# EAGLE design HEAD_IO_RevB (EAGLE 7.7.0)
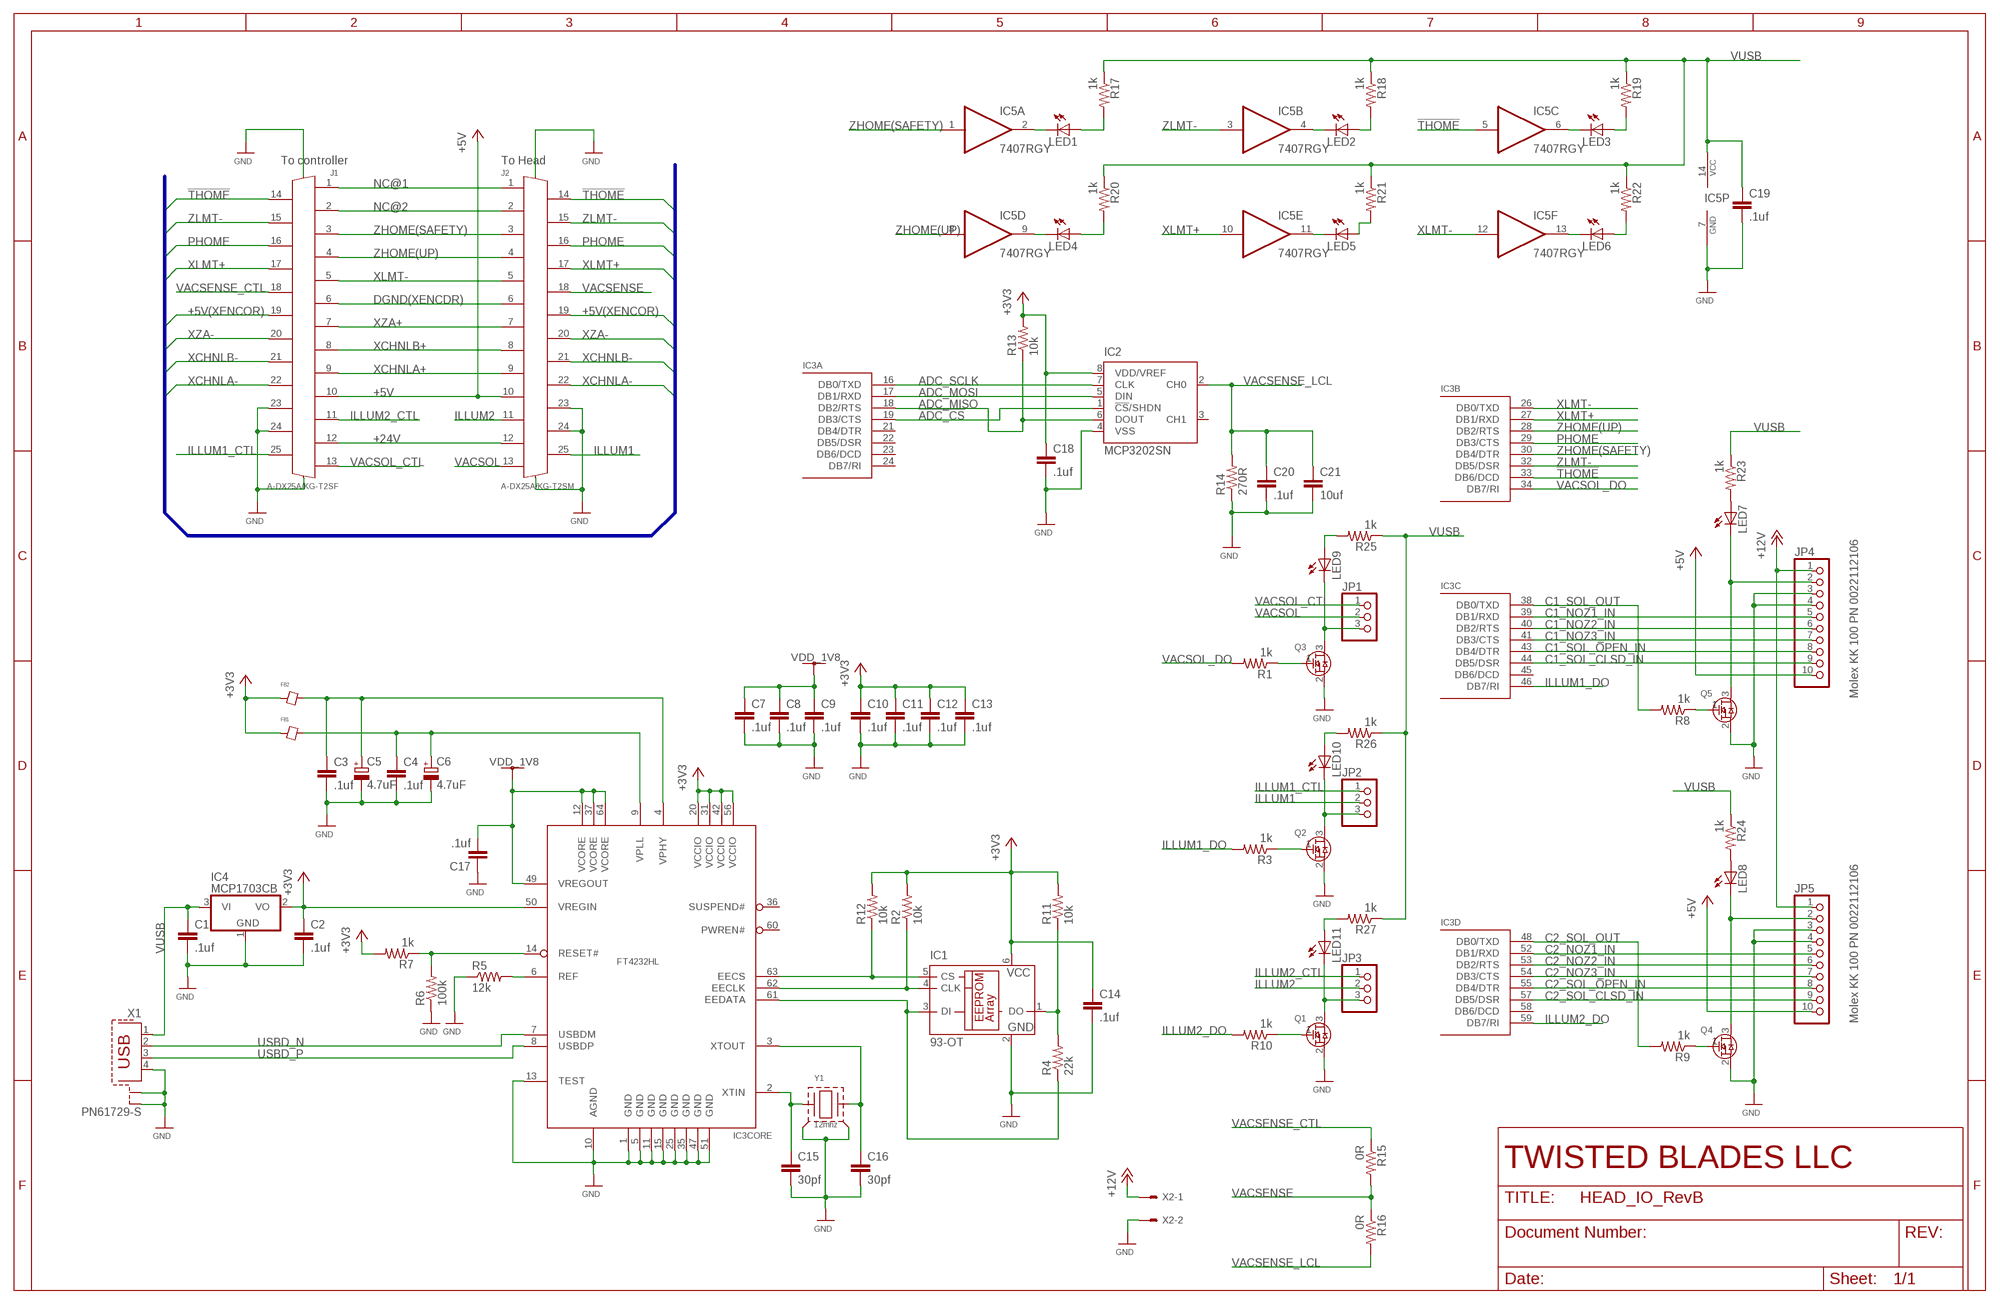
[diagram p0: schematic, sheet 1]

## Parts
C1  .1uf  C-EUC0603  [C0603]
C2  .1uf  C-EUC0603  [C0603]
C3  .1uf  C-EUC0603  [C0603]
C4  .1uf  C-EUC0603  [C0603]
C5  4.7uF  CPOL-EUA/3216-18R  [A/3216-18R]
C6  4.7uF  CPOL-EUA/3216-18R  [A/3216-18R]
C7  .1uf  C-EUC0603  [C0603]
C8  .1uf  C-EUC0603  [C0603]
C9  .1uf  C-EUC0603  [C0603]
C10  .1uf  C-EUC0603  [C0603]
C11  .1uf  C-EUC0603  [C0603]
C12  .1uf  C-EUC0603  [C0603]
C13  .1uf  C-EUC0603  [C0603]
C14  .1uf  C-EUC0603  [C0603]
C15  30pf  C-EUC0603  [C0603]
C16  30pf  C-EUC0603  [C0603]
C17  .1uf  C-EUC0603  [C0603]
C18  .1uf  C-EUC0603  [C0603]
C19  .1uf  C-EUC0603  [C0603]
C20  .1uf  C-EUC0603  [C0603]
C21  10uf  C-EUC0805K  [C0805K]
FB1  FERRITE0603  [0603]
FB2  FERRITE0603  [0603]
IC1  93-OT  [SOT23-6]
IC2  MCP3202SN  [SO-08]
IC3  FT4232HL  [LQFP64]
IC4  MCP1703CB  [SOT23]
IC5  7407RGY  [TI_VQFN14]
J1  A-DX25A/KG-T2SF  [A-DF25A/KG-T2S]
J2  A-DX25A/KG-T2SM  [A-DS25A/KG-T2S]
JP1  PINHD-1X3  [1X03]
JP2  PINHD-1X3  [1X03]
JP3  PINHD-1X3  [1X03]
JP4  PINHD-1X10  [1X10]
JP5  PINHD-1X10  [1X10]
LED1  LEDCHIP-LED0603  [CHIP-LED0603]
LED2  LEDCHIP-LED0603  [CHIP-LED0603]
LED3  LEDCHIP-LED0603  [CHIP-LED0603]
LED4  LEDCHIP-LED0603  [CHIP-LED0603]
LED5  LEDCHIP-LED0603  [CHIP-LED0603]
LED6  LEDCHIP-LED0603  [CHIP-LED0603]
LED7  LEDCHIP-LED0603  [CHIP-LED0603]
LED8  LEDCHIP-LED0603  [CHIP-LED0603]
LED9  LEDCHIP-LED0603  [CHIP-LED0603]
LED10  LEDCHIP-LED0603  [CHIP-LED0603]
LED11  LEDCHIP-LED0603  [CHIP-LED0603]
Q1  FDN86246  [SOT23C]
Q2  FDN86246  [SOT23C]
Q3  FDN86246  [SOT23C]
Q4  FDN86246  [SOT23C]
Q5  FDN86246  [SOT23C]
R1  1k  R-US_R0603  [R0603]
R2  10k  R-US_R0603  [R0603]
R3  1k  R-US_R0603  [R0603]
R4  22k  R-US_R0603  [R0603]
R5  12k  R-US_R0603  [R0603]
R6  100k  R-US_R0603  [R0603]
R7  1k  R-US_R0603  [R0603]
R8  1k  R-US_R0603  [R0603]
R9  1k  R-US_R0603  [R0603]
R10  1k  R-US_R0603  [R0603]
R11  10k  R-US_R0603  [R0603]
R12  10k  R-US_R0603  [R0603]
R13  10k  R-US_R0603  [R0603]
R14  270R  R-US_R0603  [R0603]
R15  0R  R-US_R0603  [R0603]
R16  0R  R-US_R0603  [R0603]
R17  1k  R-US_R0603  [R0603]
R18  1k  R-US_R0603  [R0603]
R19  1k  R-US_R0603  [R0603]
R20  1k  R-US_R0603  [R0603]
R21  1k  R-US_R0603  [R0603]
R22  1k  R-US_R0603  [R0603]
R23  1k  R-US_R0603  [R0603]
R24  1k  R-US_R0603  [R0603]
R25  1k  R-US_R0603  [R0603]
R26  1k  R-US_R0603  [R0603]
R27  1k  R-US_R0603  [R0603]
X1  PN61729-S  [PN61729-S]
X2  KK-156-2  [KK-156-2]
Y1  12mhz  ABM8G  [ABM8G]

## Nets
!ADC_CS: IC2.1(!CS!/SHDN) IC3.19(A:DB3/CTS)
!RESET: IC3.14(CORE:RESET#) R6.2 R7.1
!THOME: IC3.33(B:DB6/DCD) IC5.5(C:I) J1.14 J2.14
+3V3: C2.1 C10.1 C11.1 C12.1 C13.1 C14.1 C18.1 FB1.P$1 FB2.P$1 IC1.6(VCC) IC2.8(VDD/VREF) IC3.20(CORE:VCCIO) IC3.31(CORE:VCCIO) IC3.42(CORE:VCCIO) IC3.50(CORE:VREGIN) IC3.56(CORE:VCCIO) IC4.2(VO) R2.2 R7.2 R11.2 R12.2 R13.2
+5V: J1.10 J2.10 JP4.10 JP5.10
+5V(XENCOR): J1.19 J2.19
+12V: JP4.1 JP5.1 X2.1
+24V: J1.12 J2.12
ADC_MISO: IC2.6(DOUT) IC3.18(A:DB2/RTS) R13.1
ADC_MOSI: IC2.5(DIN) IC3.17(A:DB1/RXD)
ADC_SCLK: IC2.7(CLK) IC3.16(A:DB0/TXD)
C1_NOZ1_IN: IC3.39(C:DB1/RXD) JP4.5
C1_NOZ2_IN: IC3.40(C:DB2/RTS) JP4.6
C1_NOZ3_IN: IC3.41(C:DB3/CTS) JP4.7
C1_SOL_CLSD_IN: IC3.44(C:DB5/DSR) JP4.9
C1_SOL_OPEN_IN: IC3.43(C:DB4/DTR) JP4.8
C1_SOL_OUT: IC3.38(C:DB0/TXD) R8.2
C2_NOZ1_IN: IC3.52(D:DB1/RXD) JP5.5
C2_NOZ2_IN: IC3.53(D:DB2/RTS) JP5.6
C2_NOZ3_IN: IC3.54(D:DB3/CTS) JP5.7
C2_SOL_CLSD_IN: IC3.57(D:DB5/DSR) JP5.9
C2_SOL_OPEN_IN: IC3.55(D:DB4/DTR) JP5.8
C2_SOL_OUT: IC3.48(D:DB0/TXD) R9.2
DGND(XENCDR): J1.6 J2.6
GND: C1.2 C2.2 C3.2 C4.2 C5.- C6.- C7.2 C8.2 C9.2 C10.2 C11.2 C12.2 C13.2 C14.2 C15.2 C16.2 C17.1 C18.2 C19.2 C20.2 C21.2 IC1.2(GND) IC2.4(VSS) IC3.1(CORE:GND) IC3.5(CORE:GND) IC3.10(CORE:AGND) IC3.11(CORE:GND) IC3.13(CORE:TEST) IC3.15(CORE:GND) IC3.25(CORE:GND) IC3.35(CORE:GND) IC3.47(CORE:GND) IC3.51(CORE:GND) IC4.1(GND) IC5.7(P:GND) J1.23 J1.24 J1.SHLD@1(SHLD) J1.SHLD@2(SHLD) J2.23 J2.24 J2.SHLD@1(SHLD) J2.SHLD@2(SHLD) JP4.3 JP4.4 JP5.3 JP5.4 Q1.2(S) Q2.2(S) Q3.2(S) Q4.2(S) Q5.2(S) R5.1 R6.1 R14.1 X1.4 X1.S1 X1.S2 X2.2 Y1.2(GND) Y1.4(GND)
ILLUM1: J2.25 JP2.2
ILLUM1_CTL: J1.25 JP2.1
ILLUM1_DO: IC3.46(C:DB7/RI) R3.2
ILLUM2: J2.11 JP3.2
ILLUM2_CTL: J1.11 JP3.1
ILLUM2_DO: IC3.59(D:DB7/RI) R10.2
N$1: JP1.3 LED9.C Q3.3(D)
N$2: Q3.1(G) R1.1
N$3: JP2.3 LED10.C Q2.3(D)
N$4: Q2.1(G) R3.1
N$5: JP3.3 LED11.C Q1.3(D)
N$6: Q1.1(G) R10.1
N$7: C16.1 IC3.3(CORE:XTOUT) Y1.3
N$8: IC3.6(CORE:REF) R5.2
N$9: C3.1 C5.+ FB2.P$2 IC3.4(CORE:VPHY)
N$10: C15.1 IC3.2(CORE:XTIN) Y1.1
N$11: IC1.1(DO) R4.2 R11.1
N$12: IC5.2(A:O) LED1.C
N$13: IC5.4(B:O) LED2.C
N$14: IC1.5(CS) IC3.63(CORE:EECS) R12.1
N$15: IC1.4(CLK) IC3.62(CORE:EECLK) R2.1
N$16: IC1.3(DI) IC3.61(CORE:EEDATA) R4.1
N$17: IC5.6(C:O) LED3.C
N$18: IC5.9(D:O) LED4.C
N$19: C4.1 C6.+ FB1.P$2 IC3.9(CORE:VPLL)
N$20: IC5.11(E:O) LED5.C
N$21: IC5.13(F:O) LED6.C
N$22: LED1.A R17.2
N$23: LED2.A R18.2
N$24: LED3.A R19.2
N$25: LED5.A R21.2
N$26: LED6.A R22.2
N$27: LED4.A R20.2
N$28: LED7.A R23.2
N$29: LED8.A R24.2
N$30: LED11.A R27.2
N$31: Q4.1(G) R9.1
N$32: Q5.1(G) R8.1
N$33: LED9.A R25.2
N$34: LED10.A R26.2
NC@1: J1.1 J2.1
NC@2: J1.2 J2.2
PHOME: IC3.29(B:DB3/CTS) J1.16 J2.16
USBD_N: IC3.7(CORE:USBDM) X1.2
USBD_P: IC3.8(CORE:USBDP) X1.3
VAC1_SW: JP4.2 LED7.C Q5.3(D)
VAC2_SW: JP5.2 LED8.C Q4.3(D)
VACSENSE: J2.18 R15.2 R16.1
VACSENSE_CTL: J1.18 R15.1
VACSENSE_LCL: C20.1 C21.1 IC2.2(CH0) R14.2 R16.2
VACSOL: J2.13 JP1.2
VACSOL_CTL: J1.13 JP1.1
VACSOL_DO: IC3.34(B:DB7/RI) R1.2
VDD_1V8: C7.1 C8.1 C9.1 C17.2 IC3.12(CORE:VCORE) IC3.37(CORE:VCORE) IC3.49(CORE:VREGOUT) IC3.64(CORE:VCORE)
VUSB: C1.1 C19.1 IC4.3(VI) IC5.14(P:VCC) R17.1 R18.1 R19.1 R20.1 R21.1 R22.1 R23.1 R24.1 R25.1 R26.1 R27.1 X1.1
XCHNLA+: J1.9 J2.9
XCHNLA-: J1.22 J2.22
XCHNLB+: J1.8 J2.8
XCHNLB-: J1.21 J2.21
XLMT+: IC3.27(B:DB1/RXD) IC5.10(E:I) J1.17 J2.17
XLMT-: IC3.26(B:DB0/TXD) IC5.12(F:I) J1.5 J2.5
XZA+: J1.7 J2.7
XZA-: J1.20 J2.20
ZHOME(SAFETY): IC3.30(B:DB4/DTR) IC5.1(A:I) J1.3 J2.3
ZHOME(UP): IC3.28(B:DB2/RTS) IC5.8(D:I) J1.4 J2.4
ZLMT-: IC3.32(B:DB5/DSR) IC5.3(B:I) J1.15 J2.15
Unconnected: IC2.3(CH1) IC3.21(A:DB4/DTR) IC3.22(A:DB5/DSR) IC3.23(A:DB6/DCD) IC3.24(A:DB7/RI) IC3.36(CORE:SUSPEND#) IC3.45(C:DB6/DCD) IC3.58(D:DB6/DCD) IC3.60(CORE:PWREN#)

## Buses
THOME,ZLMT-,PHOME,XLMT+,+5V(XENCOR),XZA-,XCHNLB-,XCHNLA-

## Notes on the sheet
- To controller | To Head
- Molex KK 100 PN 0022112106
- Molex KK 100 PN 0022112106

## Library data of the parts
C1-C4 C7-C21 = C_rcl:C-EU: CAPACITOR, European symbol
C5 C6 = C_rcl:CPOL-EU: POLARIZED CAPACITOR, European symbol
FB1 FB2 = C_TwistedBlades:FERRITE
IC1 = C_microchip:93-*: Serial EEPROM 512 x 8 bit/256 x 16 bit/1 K/4 K, 5.0 V, Microwire; DIGIKEYPN: 93LC46BT-I/OTCT-ND
IC2 = C_microchip:MCP3202: 2.7V Dual Channel 12-Bit A/D Converter with SPI Serial Interface Source: http://ww1.microchip.com/downloads/en/DeviceDoc/21034D.pdf
IC3 = ftdichip-6:FT4232H: Quad USB UART 5th generation USB to 4-port serial controller
IC4 = C_linear:MCP1703: 250 mA, 16V, Low Quiescent Current LDO Regulator Source: http://ww1.microchip.com/downloads/en/DeviceDoc/22049b.pdf
IC5 = C_TwistedBlades:74*07: Hex BUFFER, open collector high-voltage output
J1 J2 = C_TwistedBlades:A-DX25A/KG-T2S: DB25 Connector Assmann A-D(F|S) 25 A/KG-T2S
JP1-JP3 = C_pinhead:PINHD-1X3: PIN HEADER
JP4 JP5 = pinhead:PINHD-1X10: PIN HEADER
LED1-LED11 = led-new:LED: LED OSRAM: - CHIPLED LG R971, LG N971, LY N971, LG Q971, LY Q971, LO R971, LY R971 LH N974, LH R974 LS Q976, LO Q976, LY Q976 LO Q996 - Hyper CHIPLED LW Q18S LB Q993, LB Q99A, LB R99A - SideLED LS A670, LO A670, LY A670, LG A670, LP A670 LB A673, LV A673, LT A673, LW A673 LH A674 LY A675 LS A676, LA A676, LO A676, LY A676, LW A676 LS A679, LY A679, LG A679 - Hyper Micro SIDELED® LS Y876, LA Y876, LO Y876, LY Y876 LT Y87S - SmartLED LW L88C, LW L88S LB L89C, LB L89S, LG L890 LS L89K, LO L89K, LY L89K LS L896, LA L896, LO L896, LY L896 - TOPLED LS T670, LO T670, LY T670, LG T670, LP T670 LSG T670, LSP T670, LSY T670, LOP T670, LYG T670 LG T671, LOG T671, LSG T671 LB T673, LV T673, LT T673, LW T673 LH T674 LS T676, LA T676, LO T676, LY T676, LB T676, LH T676, LSB T676, LW T676 LB T67C, LV T67C, LT T67C, LS T67K, LO T67K, LY T67K, LW E67C LS E67B, LA E67B, LO E67B, LY E67B, LB E67C, LV E67C, LT E67C LW T67C LS T679, LY T679, LG T679 LS T770, LO T770, LY T770, LG T770, LP T770 LB T773, LV T773, LT T773, LW T773 LH T774 LS E675, LA E675, LY E675, LS T675 LS T776, LA T776, LO T776, LY T776, LB T776 LHGB T686 LT T68C, LB T68C - Hyper Mini TOPLED® LB M676 - Mini TOPLED Santana® LG M470 LS M47K, LO M47K, LY M47K Source: http://www.osram.convergy.de LUXEON: - LUMILED® LXK2-PW12-R00, LXK2-PW12-S00, LXK2-PW14-U00, LXK2-PW14-V00 LXK2-PM12-R00, LXK2-PM12-S00, LXK2-PM14-U00 LXK2-PE12-Q00, LXK2-PE12-R00, LXK2-PE12-S00, LXK2-PE14-T00, LXK2-PE14-U00 LXK2-PB12-K00, LXK2-PB12-L00, LXK2-PB12-M00, LXK2-PB14-N00, LXK2-PB14-P00, LXK2-PB14-Q00 LXK2-PR12-L00, LXK2-PR12-M00, LXK2-PR14-Q00, LXK2-PR14-R00 LXK2-PD12-Q00, LXK2-PD12-R00, LXK2-PD12-S00 LXK2-PH12-R00, LXK2-PH12-S00 LXK2-PL12-P00, LXK2-PL12-Q00, LXK2-PL12-R00 Source: www.luxeon.com KINGBRIGHT: KA-3528ASYC Source: www.kingbright.com
Q1-Q5 = C_TwistedBlades:FDN86246: N-Channel PowerTrench® MOSFET 150 V, 1.6 A, 261 m http://www.fairchildsemi.com/ds/FD/FDN86246.pdf
R1-R27 = C_rcl:R-US_: RESISTOR, American symbol
X1 = con-berg:PN61729-S: BERG USB connector; DIGIKEYPN: 609-1039-ND; OC_FARNELL: unknown; OC_NEWARK: unknown
X2 = C_con-molex:KK-156-2: KK 156 HEADER Source: http://www.molex.com/pdm_docs/sd/026604100_sd.pdf; DIGIKEYPN: WM50008-02-ND; OC_FARNELL: unknown; OC_NEWARK: unknown
Y1 = C_TwistedBlades:ABM8G: Abracon Crystal http://www.abracon.com/Support/PackageDrawing/Resonators/ABM8G.PDF; DIGIKEYPN: 535-10261-1-ND

## Board
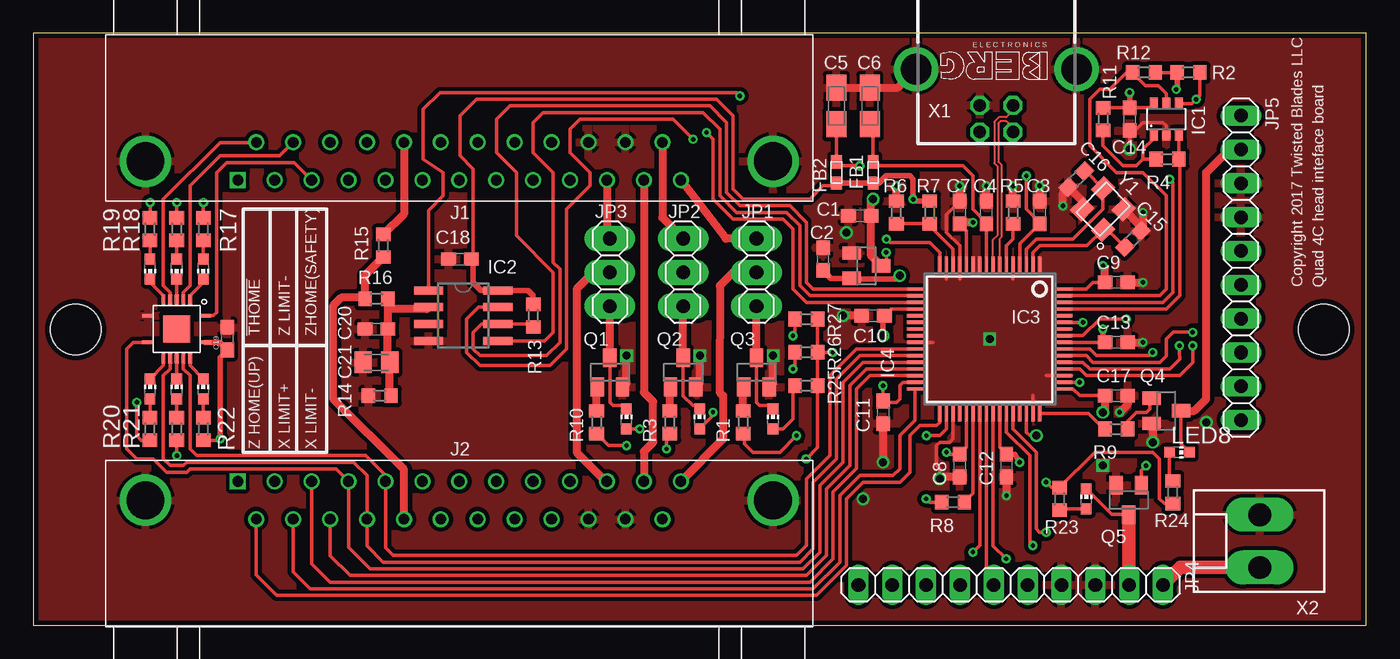
[diagram p1: board, top side]
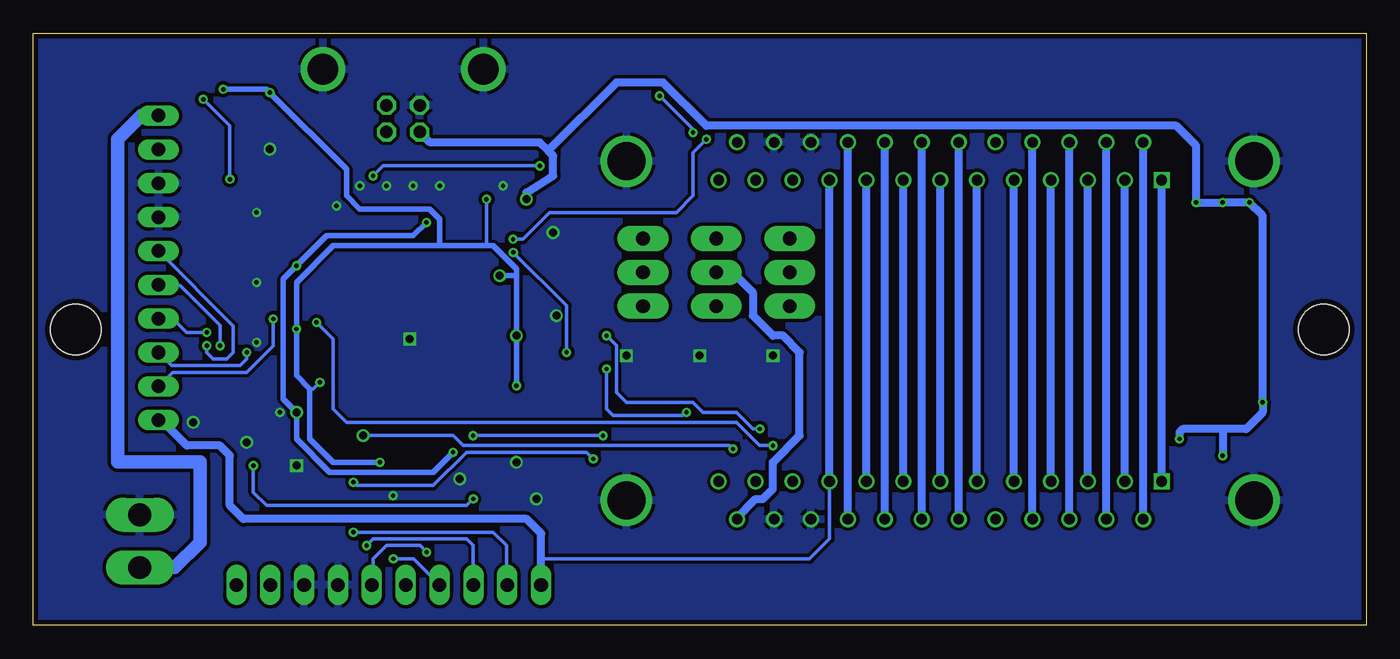
[diagram p2: board, bottom side, seen from below]

Size 100.01 x 44.45 mm. Coordinates in mm from the lower left corner, seen from the top.
Outline: 0,0 100.01,0 100.01,44.45 0,44.45 0,0
Copper layers (1*16): Top 0.0356mm / dielectric 1.5011mm / Bottom 0.0356mm
Design rules "LaenPCBOrder *": minimum track width 6mil, minimum drill 13mil, track to track 6mil, track to pad 6mil, pad to pad 6mil, via to via 6mil, smd to smd 6mil, copper to edge 15mil, drill to drill 6mil, minimum pad ring 7mil, minimum via ring 7mil, stop-mask expansion 3mil, vias tented up to drill 25mil, thermal gap 10mil
Holes 3.81 mm at 3.17,22.23 96.84,22.23

### Footprints (pad centres in the part's own frame; a part is rotated, then mirrored left to right if it is on the bottom)
C0603 = smd 1.1 x 1: 1 -0.85,0; 2 0.85,0
A/3216-18R = smd 1.95 x 1.5: + 1.375,0; - -1.375,0
C0805K = smd 1.3 x 1.6: 1 -1,0; 2 1,0
0603 = smd 1 x 0.8: P$1 -0.8,0; P$2 0.8,0
SOT23-6 = smd 0.6 x 0.9: 1 -0.95,-1.15; 2 0,-1.15; 3 0.95,-1.15; 4 0.95,1.15; 5 0,1.15; 6 -0.95,1.15
SO-08 = smd 0.6 x 2.2: 1 -1.905,-2.6; 2 -0.635,-2.6; 3 0.635,-2.6; 4 1.905,-2.6; 5 1.905,2.6; 6 0.635,2.6; 7 -0.635,2.6; 8 -1.905,2.6
LQFP64 = smd 0.25 x 1.2: 1 -3.75,-5.6; 2 -3.25,-5.6; 3 -2.75,-5.6; 4 -2.25,-5.6; 5 -1.75,-5.6; 6 -1.25,-5.6; 7 -0.75,-5.6; 8 -0.25,-5.6; 9 0.25,-5.6; 10 0.75,-5.6; 11 1.25,-5.6; 12 1.75,-5.6; 13 2.25,-5.6; 14 2.75,-5.6; 15 3.25,-5.6; 16 3.75,-5.6; 33 3.75,5.6; 34 3.25,5.6; 35 2.75,5.6; 36 2.25,5.6; 37 1.75,5.6; 38 1.25,5.6; 39 0.75,5.6; 40 0.25,5.6; 41 -0.25,5.6; 42 -0.75,5.6; 43 -1.25,5.6; 44 -1.75,5.6; 45 -2.25,5.6; 46 -2.75,5.6; 47 -3.25,5.6; 48 -3.75,5.6 | smd 1.2 x 0.25: 17 5.6,-3.75; 18 5.6,-3.25; 19 5.6,-2.75; 20 5.6,-2.25; 21 5.6,-1.75; 22 5.6,-1.25; 23 5.6,-0.75; 24 5.6,-0.25; 25 5.6,0.25; 26 5.6,0.75; 27 5.6,1.25; 28 5.6,1.75; 29 5.6,2.25; 30 5.6,2.75; 31 5.6,3.25; 32 5.6,3.75; 49 -5.6,3.75; 50 -5.6,3.25; 51 -5.6,2.75; 52 -5.6,2.25; 53 -5.6,1.75; 54 -5.6,1.25; 55 -5.6,0.75; 56 -5.6,0.25; 57 -5.6,-0.25; 58 -5.6,-0.75; 59 -5.6,-1.25; 60 -5.6,-1.75; 61 -5.6,-2.25; 62 -5.6,-2.75; 63 -5.6,-3.25; 64 -5.6,-3.75
SOT23 = smd 1 x 1.4: 1 -0.95,-1.1; 2 0.95,-1.1; 3 0,1.1
TI_VQFN14 = smd 0.85 x 0.28: 1 -2.15,-1; 7 2.15,-1; 8 2.15,1; 14 -2.15,1 | smd 0.28 x 0.85: 2 -1,-2.15; 3 -0.5,-2.15; 4 0,-2.15; 5 0.5,-2.15; 6 1,-2.15; 9 1,2.15; 10 0.5,2.15; 11 0,2.15; 12 -0.5,2.15; 13 -1,2.15 | smd 2.05 x 2.05: PAD 0,0
A-DF25A/KG-T2S = drill 0.8 square: 1 16.62,1.42 | drill 0.8: 2 13.85,1.42; 3 11.08,1.42; 4 8.31,1.42; 5 5.54,1.42; 6 2.77,1.42; 7 0,1.42; 8 -2.77,1.42; 9 -5.54,1.42; 10 -8.31,1.42; 11 -11.08,1.42; 12 -13.85,1.42; 13 -16.62,1.42; 14 15.235,-1.42; 15 12.465,-1.42; 16 9.695,-1.42; 17 6.925,-1.42; 18 4.155,-1.42; 19 1.385,-1.42; 20 -1.385,-1.42; 21 -4.155,-1.42; 22 -6.925,-1.42; 23 -9.695,-1.42; 24 -12.465,-1.42; 25 -15.235,-1.42 | drill 2.84: SHLD@1 -23.545,0; SHLD@2 23.545,0
A-DS25A/KG-T2S = drill 0.8 square: 1 -16.62,1.42 | drill 0.8: 2 -13.85,1.42; 3 -11.08,1.42; 4 -8.31,1.42; 5 -5.54,1.42; 6 -2.77,1.42; 7 0,1.42; 8 2.77,1.42; 9 5.54,1.42; 10 8.31,1.42; 11 11.08,1.42; 12 13.85,1.42; 13 16.62,1.42; 14 -15.235,-1.42; 15 -12.465,-1.42; 16 -9.695,-1.42; 17 -6.925,-1.42; 18 -4.155,-1.42; 19 -1.385,-1.42; 20 1.385,-1.42; 21 4.155,-1.42; 22 6.925,-1.42; 23 9.695,-1.42; 24 12.465,-1.42; 25 15.235,-1.42 | drill 2.84: SHLD@1 -23.545,0; SHLD@2 23.545,0
1X03 = drill 1.016 pad 1.93 long: 1 -2.54,0; 2 0,0; 3 2.54,0
1X10 = drill 1.016 long: 1 -11.43,0; 2 -8.89,0; 3 -6.35,0; 4 -3.81,0; 5 -1.27,0; 6 1.27,0; 7 3.81,0; 8 6.35,0; 9 8.89,0; 10 11.43,0
CHIP-LED0603 = smd 0.8 x 0.8: A 0,-0.75; C 0,0.75
SOT23C = smd 1 x 1.4: 1 -0.95,-1.1; 2 0.95,-1.1; 3 0,1.1
R0603 = smd 1 x 1.1: 1 -0.85,0; 2 0.85,0
PN61729-S = drill 0.95 octagon: 1 1.25,4.71; 2 -1.25,4.71; 3 -1.25,2.71; 4 1.25,2.71 | drill 2.3 pad 2.9: S1 -6.02,0; S2 6.02,0
KK-156-2 = drill 1.7 pad 2.184 long: 1 -1.98,0; 2 1.98,0
ABM8G = smd 1.4 x 1.2: 1 -1.1,-1.1; 2 1.1,-1.1; 3 1.1,1.1; 4 -1.1,1.1

### Placement (x,y rotation side)
C1  62.01,30.75 180 top
C2  59.26,27.5 90 top
C3  75.51,31 90 top
C4  71.51,31 90 top
C5  60.26,39 270 top
C6  62.76,39 270 top
C7  69.51,31 90 top
C8  69.51,12 270 top
C9  81.26,25.75 0 top
C10  63.01,23.25 180 top
C11  63.76,16 270 top
C12  73.01,12 270 top
C13  81.26,21.25 0 top
C14  82.26,38 270 top
C15  82.51,29 45 top
C16  78.26,33.5 225 top
C17  81.26,17.25 180 top
C18  32.01,27.5 180 top
C19  14.56,21.52 90 top
C20  25.75,22.25 180 top
C21  25.75,19.75 180 top
FB1  63.01,34 90 top
FB2  60.26,34 90 top
IC1  85.01,38 0 top
IC2  32.26,23.25 270 top
IC3  71.76,21.5 180 top
IC4  62.51,27 270 top
IC5  10.76,22.25 180 top
J1  31.96,34.85 180 top
J2  31.96,9.4 0 top
JP1  54.26,26.5 270 top
JP2  48.76,26.5 270 top
JP3  43.26,26.5 270 top
JP4  73.34,3.05 180 top
JP5  90.61,26.84 270 top
LED1  12.76,26.75 180 top
LED2  10.76,26.75 180 top
LED3  8.76,26.75 180 top
LED4  8.76,17.75 0 top
LED5  10.76,17.75 0 top
LED6  12.76,17.75 0 top
LED7  79,9.5 0 top
LED8  86,13 270 top
LED9  55.5,15.5 0 top
LED10  50,15.5 0 top
LED11  44.5,15.5 0 top
Q1  43.26,19 0 top
Q2  48.76,19 0 top
Q3  54.26,19 0 top
Q4  85.01,16.11 270 top
Q5  82.2,9.43 180 top
R1  53.26,15.25 270 top
R2  86.67,41.5 180 top
R3  47.76,15.25 270 top
R4  85.1,35 180 top
R5  73.51,31 270 top
R6  64.76,31 270 top
R7  67.26,31 90 top
R8  69.01,9.25 0 top
R9  81.26,14.75 180 top
R10  42.26,15.25 270 top
R11  80.26,38 90 top
R12  83.34,41.5 0 top
R13  37.51,23.25 90 top
R14  26,17.24 0 top
R15  26.26,28.5 270 top
R16  25.75,24.51 0 top
R17  12.76,29.75 270 top
R18  10.76,29.75 270 top
R19  8.76,29.75 270 top
R20  8.76,14.75 90 top
R21  10.76,14.75 90 top
R22  12.76,14.75 90 top
R23  77,9.5 270 top
R24  85.5,10 90 top
R25  58,18 180 top
R26  58,20.5 180 top
R27  58,23 180 top
X1  72.26,41.75 180 top
X2  92.03,6.33 90 top
Y1  80.26,31.25 45 top

### Tracks (layer width: path | path; a pad name or v marks a point on that pad's centre or on a via)
!ADC_CS  (via drill 0.33)
  Top 0.254: IC2.1 29.66,31.15 30.76,32.25 30.76,34 29.26,35 29.26,38.75 30.51,40 52.76,40 v53.01,39.75 | IC3.19 58.01,24.25 57.01,25.25 57.01,29.75 56.26,30.5 52.51,30.5 51.01,32 51.01,36.5 v50.51,37
  Bottom 0.254: v50.51,37 50.51,37.25 v53.01,39.75
!RESET
  Top 0.254: IC3.14 69.01,28.25 67.51,29.75 R7.1 R6.2
!THOME
  Top 0.254: J2.14 16.73,3.79 18.26,2.25 58.76,2.25 61.01,4.5 61.01,9.5 62.26,10.75 65.01,10.75 65.76,11.5 65.76,14.25 66.51,15 67.76,15 68.01,15.25 IC3.33 | IC5.5 10.26,25 9.76,25.5 9.76,32 14.01,36.25 16.71,36.25 J1.14
  Bottom 0.61: J2.14 J1.14
+3V3  (via drill 0.33, 0.6)
  Top 0.254: C13.1 IC3.56 | IC3.42 72.51,13.35 C12.1 | R11.2 C14.1 83.76,38.85 IC1.6 | IC3.50 v78.51,18.25 | 33.01,27.35 33.01,34.25 32.01,35.25 32.01,38.25 33.26,39.5 51.26,39.5 52.51,38.25 52.51,32.75 53.26,32 58.26,32 59.26,33 60.06,33 FB2.P$1 | IC3.20 64.36,23.75 C10.1 | IC3.31 65.26,18.25 65.01,18 65.01,17 64.76,16.75 63.86,16.75 C11.1 v63.76,18 | R2.2 R12.2
  Top 0.406: v80.26,22.25 80.26,21.4 C13.1 | v74.01,12.25 73.66,12.85 C12.1 | R7.2 66.16,31.85 v66.01,32 66.01,33.5 65.76,33.75 64.01,33.75 63.46,33.2 FB1.P$1 FB2.P$1 | C14.1 v82.26,40 | v63.76,21.75 63.76,23.15 C10.1 | 33.01,27.35 33.01,25.75 33.61,25.16 IC2.8 37.11,25.16 37.51,24.75 R13.2 | v65.01,26.25 64.76,26 61.46,26 IC4.2 59.86,26.05 C2.1 | R2.2 85.83,40.31 v85.76,40.25
  Top 0.61: 61.31,26.15 IC4.2 | 33.01,27.35 C18.1
  Bottom 0.254: v78.51,18.25 79.01,17.75 79.26,17.75 | v66.01,32 66.01,28.5
  Bottom 0.406: v74.01,12.25 77.51,12.25 79.26,14 79.26,17.75 80.26,18.75 v80.26,22.25 80.26,25.75 77.51,28.5 69.51,28.5 | 69.51,28.5 66.01,28.5 65.51,28.5 63.76,26.75 63.76,26.25 | 63.76,26.25 v63.76,21.75 v63.76,18 | 69.51,28.5 69.51,30.5 70.26,31.25 75.51,31.25 76.51,32.25 76.51,34.25 v82.26,40 82.51,40.25 v85.76,40.25 | v65.01,26.25 63.76,26.25
+5V
  Bottom 0.254: J2.10 40.27,6.49 41.76,5 61.91,5
  Bottom 0.61: J2.10 J1.10 | JP4.10 61.91,5 61.91,6.91 63,8 84.26,8 85.26,9 85.26,12.75 86.01,13.5 88.5,13.5 90.41,15.41 JP5.10
+5V(XENCOR)
  Bottom 0.61: J2.19 J1.19
+12V
  Top 1.016: JP4.1 86.07,4.34 X2.1
  Bottom 1.016: X2.1 89.39,4.34 87.49,6.25 87.49,12.28 93.66,12.28 93.66,36.51 91.91,38.27 JP5.1
+24V
  Top 0.61: J1.12 45.81,17.5 46.5,16.81 46.5,13.75 45.81,13.06 J2.12
ADC_MISO
  Top 0.254: 37.3,22.61 IC2.6 33.63,22.61 33.01,22 33.01,20.75 33.51,20.25 38.51,20.25 39.51,21.25 39.51,26.75 39.01,27.25 39.01,34 37.51,35.5 37.51,37.75 38.26,38.5 50.26,38.5 51.51,37.25 51.51,32.25 52.76,31 56.51,31 57.51,30 57.51,25.5 58.26,24.75 IC3.18
  Top 0.61: 37.3,22.61 R13.1
ADC_MOSI
  Top 0.254: IC2.5 38.36,21.34 39.01,22 39.01,26.5 36.26,29.25 36.26,34 34.76,35.5 34.76,38 35.76,39 50.76,39 52.01,37.75 52.01,32.5 53.01,31.5 56.76,31.5 58.01,30.25 58.01,25.75 58.51,25.25 IC3.17
ADC_SCLK  (via drill 0.33)
  Top 0.254: IC2.7 33.4,23.89 32.51,23 32.51,20.5 33.51,19.5 38.76,19.5 40.01,20.75 40.01,31.25 41.76,33 41.76,34 40.26,35.5 40.26,37.25 41.01,38 48.01,38 v49.51,36.5 | IC3.16 68.01,28 67.26,28.75 64.26,28.75 v64.01,29
  Bottom 0.254: v64.01,29 63.26,29 61.26,31 51.76,31 50.51,32.25 50.51,35.5 v49.51,36.5
C1_NOZ1_IN  (via drill 0.33)
  Top 0.254: IC3.39 71.01,6.01 v70.5,5.5
  Bottom 0.254: v70.5,5.5 71,6 73.5,6 74.5,5 74.5,3.16 JP4.5
C1_NOZ2_IN
  Top 0.254: IC3.40 71.51,3.61 JP4.6
C1_NOZ3_IN  (via drill 0.33)
  Top 0.254: IC3.41 72.01,5.99 v73,5
  Bottom 0.254: v73,5 71.48,5 JP4.7
C1_SOL_CLSD_IN  (via drill 0.33)
  Top 0.254: IC3.44 73.51,14.75 75.26,13 75.26,7.24 75.5,7 v76,7
  Bottom 0.254: v76,7 65.5,7 64.5,6 64.5,3.1 JP4.9
C1_SOL_OPEN_IN  (via drill 0.33)
  Top 0.254: IC3.43 73.01,14.5 74.76,12.75 74.76,6.24 v75,6
  Bottom 0.254: v75,6 74.5,6.5 67.5,6.5 67,6 JP4.8
C1_SOL_OUT
  Top 0.254: IC3.38 70.51,9.9 R8.2
C2_NOZ1_IN  (via drill 0.33)
  Top 0.254: IC3.52 78.51,19.25 79.01,18.75 86.01,18.75 87.01,19.75 87.01,20.99 v87,21
  Bottom 0.254: v87,21 87,20.5 86.5,20 85.5,20 85,20.5 85,22.5 JP5.5
C2_NOZ2_IN  (via drill 0.33)
  Top 0.254: IC3.53 78.76,19.75 79.26,19.25 85.26,19.25 86.01,20 86,20.51 v86,21
  Bottom 0.254: v86,21 86,22.5 89,25.5 90.54,25.5 JP5.6
C2_NOZ3_IN  (via drill 0.33)
  Top 0.254: IC3.54 79.01,20.25 79.51,19.75 84.51,19.75 85,20.24 85,21.5 85.53,22.03 86.97,22.03 v87,22
  Bottom 0.254: v87,22 88.5,22 89.5,23 90.58,23 JP5.7
C2_SOL_CLSD_IN  (via drill 0.33)
  Top 0.254: IC3.57 78.76,21.75 80.01,23 v82.01,23
  Bottom 0.254: v82.01,23 82.01,20.99 84,19 89.56,19 JP5.9
C2_SOL_OPEN_IN  (via drill 0.33)
  Top 0.254: IC3.55 79.26,20.75 79.76,20.25 83.75,20.25 v84,20.5
  Bottom 0.254: v84,20.5 84,20 84.5,19.5 89.62,19.5 JP5.8
C2_SOL_OUT
  Top 0.254: IC3.48 79.16,15.9 80.06,15 R9.2
DGND(XENCDR)
  Bottom 0.61: J2.6 J1.6
GND  (via drill 0.33, 0.6)
  Top 0.254: C7.2 68.51,30.85 68.51,29.5 69.51,28.5 IC3.13 69.51,26 | IC3.35 69.01,14 68.76,13.75 68.01,13.75 67.76,13.5 67.76,12 68.01,11.75 v68.01,11 | IC1.2 85.01,37.5 84.76,37.75 83.26,37.75 82.66,37.15 C14.2 v82.26,35.75 | IC3.15 68.51,26 | IC3.5 73.51,26 | IC3.51 76.01,18.75 | IC3.47 75.01,17.25 | IC3.25 67.51,21.25
  Top 0.61: C8.2 68.16,11.15 v68.01,11 | C12.2 v73.01,9.75 | Q4.2 84.01,15.01 v84.01,13.75 | C9.2 v83.26,25.75 | C7.2 v69.51,33 | R5.1 v73.51,33 | 61.31,27.85 IC4.1 | C10.2 v60.76,23.25 | C13.2 v83.26,21.25 | Y1.2 83.11,29.95 C15.2 83.26,29.75 v83.26,31 | Y1.4 78.71,31.85 C16.2 77.26,32.5 v77.26,31.5 | C17.1 82.11,16.6 v81.51,16 | C3.2 v75.51,33 | C4.2 v71.51,33 | R6.1 v64.76,33 | C5.- C6.- 64.87,40.38 X1.S2 | C11.2 v63.76,12.25 | Q1.2 44.51,18.2 v44.51,20.25 | Q2.2 50.01,18.2 v50.01,20.25 | Q3.2 55.51,18.2 v55.51,20.25
  other vias: 62.26,9.5 71.76,21.5 61.01,29.5 80.26,12 88.01,15.25
  pour Bottom (isolate 0.254): 0,44.45 0,0 100.01,0 100.01,44.45
  pour Top: 58.51,31.25 58.51,27 62.26,27 62.26,31.25
  pour Top (isolate 0.305, no thermals): 64.76,28.5 64.76,14.5 78.76,14.5 78.76,28.5
  pour Top (isolate 0.305): 0,44.45 100.01,44.45 100.01,0 0,0
ILLUM1
  Bottom 0.61: JP2.2 47.51,26.5 46.01,25 46.01,23.25 44.51,21.75 43.75,21.75 42.51,20.5 42.51,14.25 44.51,12.25 44.51,10.25 45.26,9.5 45.81,9.5 47.26,8.04 J2.25
ILLUM1_CTL
  Top 0.61: J1.25 47.2,30.61 JP2.1
ILLUM1_DO  (via drill 0.33, 0.6)
  Top 0.254: IC3.46 74.51,14.5 74.76,14.25 v75.26,14.25 | v47.51,13.25 47.51,14.15 R3.2
  Bottom 0.254: v75.26,14.25 68.51,14.25 67.76,13.5 47.76,13.5 v47.51,13.25
ILLUM2
  Top 0.61: JP3.2 42.01,26.5 40.76,25.25 40.76,13 42.91,10.85 43.01,10.85 J2.11
ILLUM2_CTL
  Top 0.61: J1.11 43.04,29.26 JP3.1
ILLUM2_DO  (via drill 0.33)
  Top 0.254: IC3.59 v78.76,22.75 | v44.51,13.5 43.16,13.5 R10.2
  Bottom 0.254: v78.76,22.75 77.51,21.5 77.51,16.25 76.51,15.25 47.26,15.25 45.51,13.5 v44.51,13.5
N$1
  Top 0.254: Q3.3 54.26,16.74 54.5,16.5 55.25,16.5 LED9.C
  Top 0.61: Q3.3 JP1.3
N$2
  Top 0.61: R1.1 53.26,17.85 Q3.1
N$3
  Top 0.254: Q2.3 48.76,17.24 49.5,16.5 49.75,16.5 LED10.C
  Top 0.61: Q2.3 JP2.3
N$4
  Top 0.61: R3.1 47.76,17.85 Q2.1
N$5
  Top 0.254: Q1.3 43.26,16.74 43.5,16.5 44.25,16.5 LED11.C
  Top 0.61: Q1.3 JP3.3
N$6
  Top 0.61: R10.1 42.26,17.85 Q1.1
N$7
  Top 0.254: IC3.3 74.51,28.25 75.26,29 78.01,29 80.26,31.25 Y1.3 78.97,34.1 C16.1
N$8
  Top 0.254: IC3.6 73.01,28.5 73.51,29 R5.2
N$9  (via drill 0.33)
  Top 0.254: IC3.4 74.01,28.65 C3.1 75.51,30.25 74.51,31.25 v74.51,33.75 | C5.+ FB2.P$2 60.56,34.5 v62.01,34.5
  Bottom 0.254: v74.51,33.75 73.76,34.5 v62.01,34.5
N$10
  Top 0.254: IC3.2 75.01,28 75.51,28.5 79.07,28.5 Y1.1 80.62,29.69 C15.1
N$11
  Top 0.254: IC1.1 84.06,36.55 83.26,35.75 83.26,35 | 83.26,35 82.76,34.5 81.76,34.5 80.26,36 R11.1 | R4.2 83.26,35
N$12
  Top 0.254: IC5.2 11.76,24.75 12.76,25.75 LED1.C
N$13
  Top 0.254: LED2.C IC5.4
N$14
  Top 0.254: IC1.5 85.01,39.9 84.41,40.5 83.42,40.5 82.49,41.44 R12.1 82.01,41.5 80.76,40.25 80.01,40.25 79.26,39.5 79.26,36 81.26,34 83.26,34 85.01,32.25 85.01,25.25 84.51,24.75 IC3.63
N$15  (via drill 0.33)
  Top 0.254: IC3.62 84.76,24.25 85.51,25 85.51,33.25 v85.26,33.5 | 85.96,39.2 IC1.4 86.91,39.15 v87.26,39.5 87.53,39.76 R2.1
  Bottom 0.254: v85.26,33.5 85.26,37.5 v87.26,39.5
N$16
  Top 0.254: IC1.3 85.96,35.01 R4.1 85.76,34.81 86.01,34.5 86.01,24.75 85.01,23.75 IC3.61
N$17
  Top 0.254: IC5.6 9.76,24.75 8.76,25.75 LED3.C
N$18
  Top 0.254: IC5.9 9.76,19.5 LED4.C
N$19
  Top 0.254: IC3.9 C4.1 71.51,30.25 70.51,31.25 70.51,33.75 69.76,34.5 63.31,34.5 FB1.P$2 63.01,37.38 C6.+
N$20
  Top 0.254: IC5.11 LED5.C
N$21
  Top 0.254: IC5.13 11.76,19.5 LED6.C
N$22
  Top 0.254: LED1.A R17.2
N$23
  Top 0.254: LED2.A R18.2
N$24
  Top 0.254: LED3.A R19.2
N$25
  Top 0.254: R21.2 LED5.A
N$26
  Top 0.254: R22.2 LED6.A
N$27
  Top 0.254: R20.2 LED4.A
N$28
  Top 0.254: R23.2 77.1,8.75 LED7.A
N$29
  Top 0.254: R24.2 85.25,11.1 LED8.A
N$30  (via drill 0.33)
  Top 0.254: LED11.A v45.5,14.75 | R27.2 57.15,21.9 v57,21.75
  Bottom 0.254: v45.5,14.75 46,14.75 47.25,16 49.75,16 50.5,16.75 55.5,16.75 56.25,17.5 56.25,21 v57,21.75
N$31
  Top 0.254: R9.1 82.11,15.35 82.76,16 83.51,16 83.76,16.25 83.76,16.91 Q4.1
N$32  (via drill 0.33)
  Top 0.254: R8.1 67.25,9.25 v67,9.5 | v83.5,12 83.15,11.65 Q5.1
  Bottom 0.254: v67,9.5 67.5,9 82.5,9 83.5,10 v83.5,12
N$33
  Top 0.254: LED9.A 56.25,14.75 57,15.5 57,17.85 R25.2
N$34  (via drill 0.33)
  Top 0.254: R26.2 57.15,19.4 v57,19.25 | v51,16 51,15.75 LED10.A
  Bottom 0.254: v57,19.25 57,16.25 56.5,15.75 51.25,15.75 v51,16
NC@1
  Bottom 0.61: J2.1 J1.1
NC@2
  Bottom 0.61: J2.2 J1.2
PHOME
  Top 0.254: J2.16 22.27,5.25 23.76,3.75 58.01,3.75 59.51,5.25 59.51,10.25 61.26,12 61.26,18 62.51,19.25 IC3.29
  Bottom 0.61: J2.16 J1.16
USBD_N
  Top 0.152: IC3.7 72.51,29.03 72.67,29.19 72.67,34.56 72.42,34.81 72.42,37.69 72.58,37.85 73.01,37.85 73.51,37.35 X1.2
USBD_P
  Top 0.152: IC3.8 72.01,28.97 72.36,29.31 72.36,34.44 72.11,34.69 72.11,37.81 72.45,38.15 73.01,38.15 73.51,38.65 X1.3
VAC1_SW
  Top 0.254: LED7.C 80.92,8.32 Q5.3
  Top 1.016: Q5.3 82.2,3.08 JP4.2
VAC2_SW
  Top 0.254: LED8.C 86.11,13.64 Q4.3
  Top 0.61: Q4.3 87.11,16.11 88,17 88,34 89.5,35.5 90.39,35.5 JP5.2
VACSENSE
  Top 0.61: J2.18 27.81,11.71 22.5,17.01 22.5,24 23.1,24.6 24.81,24.6 R16.1 24.9,26.29 R15.2
VACSENSE_CTL
  Top 0.61: J1.18 27.81,30.89 R15.1
VACSENSE_LCL
  Top 0.61: R14.2 26.75,17.34 C21.1 26.6,19.9 C20.1 26.6,23.75 | R16.2 26.6,23.75 | IC2.2 29.53,23.75 26.6,23.75
VACSOL
  Top 0.61: JP1.2 52.51,26.5 51.51,25.5 51.5,17.5 51.76,17.24 51.76,14 J2.13
VACSOL_CTL
  Top 0.61: JP1.1 51.97,29.04 J1.13
VACSOL_DO  (via drill 0.33)
  Top 0.254: IC3.34 68.51,14.75 68.01,14.25 v67.01,14.25 | R1.2 53.36,14.25 53.36,13.64 54,13 56.01,13 v57.26,14.25
  Bottom 0.254: v67.01,14.25 v57.26,14.25
VDD_1V8  (via drill 0.33, 0.6)
  Top 0.254: IC3.37 70.01,13.35 C8.1 68.66,12.85 v68.51,13 | IC3.12 70.01,29.65 C7.1 | IC3.64 79.01,25.25 79.51,25.75 C9.1 | IC3.49 78.01,17.75 78.51,17.25 C17.2
  Top 0.61: C17.2 80.41,16.15 v80.26,16 | C9.1 80.41,26.85 v80.26,27 | v70.51,30.25 69.61,30.25 C7.1
  Bottom 0.406: v68.51,13 70.01,11.5 77.76,11.5 80.26,14 v80.26,16 81.26,17 81.26,26 v80.26,27 78.01,29.25 71.51,29.25 v70.51,30.25
VUSB  (via drill 0.33, 0.6)
  Top 0.254: R20.1 8.11,13.9 7.76,14.25 v7.76,16.75 | R22.1 13.91,13.9 v14.01,14 | v10.76,12.75 R21.1 | R19.1 v8.76,31.75 | v10.76,31.75 R18.1 | R17.1 v12.76,31.75 | R26.1 R25.1 58.85,13.35 v58,12.5 | R26.1 v60,20.5 | v64,28 64,27.39 IC4.3 | R27.1 R26.1 | R24.1 84.85,9.15 84.5,9.5 84.5,12.5 84,13 79.65,13 R23.1 76.4,10.35 v76,10.75
  Top 0.406: v14.01,14 14.01,20.12 C19.1 13.99,21.25 IC5.14
  Top 0.61: IC4.3 62.86,27.75 C1.1 62.86,31.85 v63.01,32
  Bottom 0.254: v60,20.5 60,24 v64,28 | v76,10.75 75.75,10.5 70,10.5 67.5,13 58.5,13 v58,12.5
  Bottom 0.61: v63.01,32 63.01,32.5 61.01,33.75 61.01,35.25 61.39,35.62 | 61.39,35.62 62.01,36.25 70.22,36.25 X1.1 | 10.76,14.75 9.01,14.75 7.76,16 v7.76,16.75 7.76,30.75 v8.76,31.75 v10.76,31.75 v12.76,31.75 12.76,36 14.26,37.5 49.51,37.5 52.76,40.75 56.26,40.75 61.39,35.62 | 10.76,14.75 13.76,14.75 14.01,14.5 v14.01,14 | 10.76,14.75 v10.76,12.75
XCHNLA+
  Bottom 0.61: J2.9 J1.9
XCHNLA-
  Bottom 0.61: J2.22 J1.22
XCHNLB+
  Bottom 0.61: J2.8 J1.8
XCHNLB-
  Bottom 0.61: J2.21 J1.21
XLMT+
  Top 0.254: IC3.27 62.01,20.25 60.26,18.5 60.26,12.5 58.51,10.75 58.51,5.75 57.51,4.75 26.26,4.75 25.04,5.97 J2.17 25.04,11.25 24.04,12.25 11.51,12.25 11.26,12 10.26,12 9.76,12.5 9.76,18.75 10.26,19.25 IC5.10
  Bottom 0.61: J2.17 J1.17
XLMT-
  Top 0.254: IC3.26 61.76,20.75 59.76,18.75 59.76,12.75 58.01,11 58.01,6 57.26,5.25 27.01,5.25 26.42,5.84 J2.5 26.42,11.25 24.92,12.75 12.26,12.75 11.76,13.25 11.76,18.75 11.26,19.25 IC5.12
  Bottom 0.61: J2.5 J1.5
XZA+
  Bottom 0.61: J2.7 J1.7
XZA-
  Bottom 0.61: J2.20 J1.20
ZHOME(SAFETY)
  Top 0.254: J2.3 20.88,4.63 22.26,3.25 58.26,3.25 60.01,5 59.98,10.02 61.76,11.8 61.76,17.75 62.76,18.75 IC3.30 | IC5.1 13.51,23.25 13.76,23.5 13.76,34 14.51,34.75 19.56,34.75 J1.3
  Bottom 0.61: J2.3 J1.3
ZHOME(UP)
  Top 0.254: IC3.28 62.26,19.75 60.76,18.25 60.76,12.25 59.01,10.5 59.01,5.5 57.76,4.25 25.26,4.25 23.65,5.86 J2.4 22.72,11.75 11.76,11.75 11.51,11.5 10.01,11.5 9.01,12.5 7.76,12.5 7.01,13.25 7.01,20.75 7.51,21.25 IC5.8
  Bottom 0.61: J2.4 J1.4
ZLMT-
  Top 0.254: J2.15 19.5,4.01 20.76,2.75 58.51,2.75 60.51,4.75 60.51,9.75 62.01,11.25 64.51,11.25 65.01,11.75 65.01,14.25 66.16,15.4 IC3.32 | IC5.3 11.26,25 11.76,25.5 11.76,33 14.01,35.25 18.48,35.25 J1.15
  Bottom 0.61: J2.15 J1.15

### Text on the board
tNames: Copyright 2017 Twisted Blades LLC | Quad 4C head inteface board | !THOME | Z LIMIT- | ZHOME(SAFETY) | Z HOME(UP) | X LIMIT+ | X LIMIT-